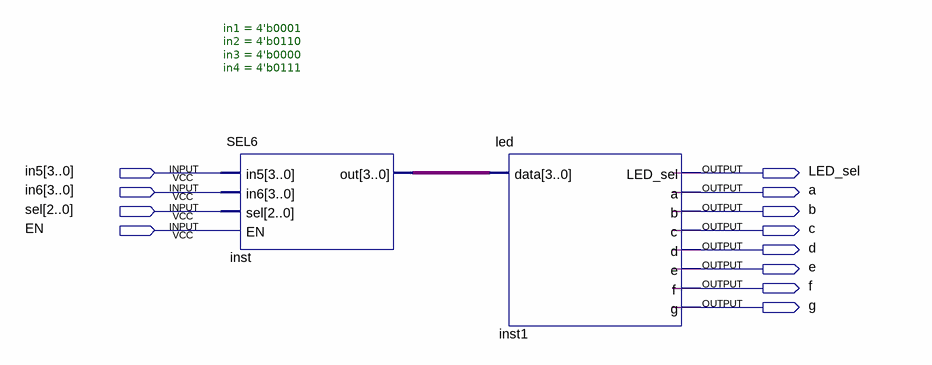
[diagram p0: schematic sheet]
// Quartus schematic project3.bdf as structural Verilog: 2 symbols, 12 pins
module project3 (
  input  [3:0] in5,
  input  [3:0] in6,
  input  [2:0] sel,
  input  EN,
  output LED_sel,
  output a,
  output b,
  output c,
  output d,
  output e,
  output f,
  output g
);

  wire [3:0] inst_out;

  SEL6 #(.in1(4'b0001), .in2(4'b0110), .in3(4'b0000), .in4(4'b0111)) inst (
    .in5(in5), .in6(in6), .sel(sel), .EN(EN), .out(inst_out));
  led inst1 (.data(inst_out), .LED_sel(LED_sel), .a(a), .b(b), .c(c), .d(d), .e(e), .f(f), .g(g));
endmodule
